# Altium schematic sheet Main sheet.SchDoc: BBB, Status LEDs and I/O pins
size A; DrawnBy: Mr.Farhad Jafari; Engineer: Mr.Farhad Jafari; Address1: www.BasetP.com; Address2: www.BasetP.com; Address3: www.BasetP.com; Address4: www.BasetP.com; Revision: V1.1; SheetNumber: 1; SheetTotal: 5; ProjectName: Humanoid robot
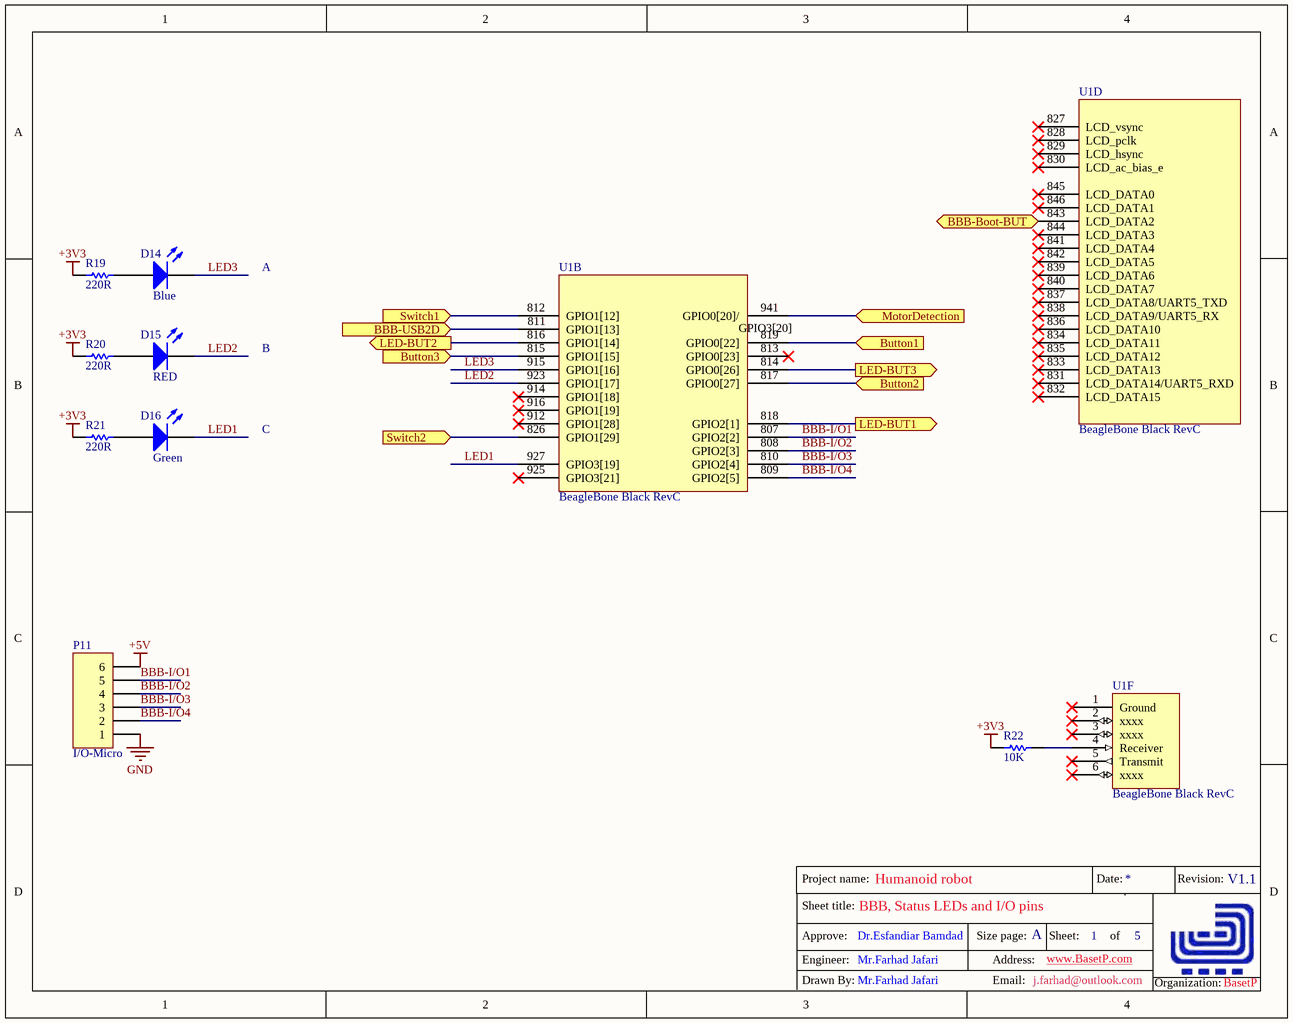
[diagram p0: Main sheet.SchDoc]

## Parts
D14  Blue  [led Blue-0805]
D15  RED  [LED Red-0805]
D16  Green  [LED Green-0805]
P11  I/O-Micro  [HDR1X6]
R19  220R  [6-0805]
R20  220R  [6-0805]
R21  220R  [6-0805]
R22  10K  [6-0805]
U1  BeagleBone Black RevC  [BBB-C]  (parts B,D,F of 6)

## Ports
BBB-Boot-BUT (in), BBB-USB2D (in), Button1 (in), Button2 (in), Button3 (in), LED-BUT1 (out), LED-BUT2 (out), LED-BUT3 (out), MotorDetection (in), Switch1 (in), Switch2 (in)

## Nets
+3V3: R19.1 R20.1 R21.1 R22.1
+5V: P11.6
GND: P11.1
BBB-Boot-BUT: U1.843(LCD_DATA2) ; port BBB-Boot-BUT
BBB-I/O1: P11.5 U1.807(GPIO2[2])
BBB-I/O2: P11.4 U1.808(GPIO2[3])
BBB-I/O3: P11.3 U1.810(GPIO2[4])
BBB-I/O4: P11.2 U1.809(GPIO2[5])
BBB-USB2D: U1.811(GPIO1[13]) ; port BBB-USB2D
Button1: U1.819(GPIO0[22]) ; port Button1
Button2: U1.817(GPIO0[27]) ; port Button2
Button3: U1.815(GPIO1[15]) ; port Button3
LED1: D16.2(K) U1.927(GPIO3[19])
LED2: D15.2(K) U1.923(GPIO1[17])
LED3: D14.2(K) U1.915(GPIO1[16])
LED-BUT1: U1.818(GPIO2[1]) ; port LED-BUT1
LED-BUT2: U1.816(GPIO1[14]) ; port LED-BUT2
LED-BUT3: U1.814(GPIO0[26]) ; port LED-BUT3
MotorDetection: U1.941(GPIO0[20]/) ; port MotorDetection
Switch1: U1.812(GPIO1[12]) ; port Switch1
Switch2: U1.826(GPIO1[29]) ; port Switch2
NetD14_1: D14.1(A) R19.2
NetD15_1: D15.1(A) R20.2
NetD16_1: D16.1(A) R21.2
NetR22_2: R22.2 U1.4(Receiver)

Not connected (* = marked no-connect by the designer): U1 1(Ground)* 2(xxxx)* 3(xxxx)* 5(Transmit)* 6(xxxx)* 813(GPIO0[23])* 827(LCD_vsync)* 828(LCD_pclk)* 829(LCD_hsync)* 830(LCD_ac_bias_e)* 831(LCD_DATA14/UART5_RXD)* 832(LCD_DATA15)* 833(LCD_DATA13)* 834(LCD_DATA11)* 835(LCD_DATA12)* 836(LCD_DATA10)* 837(LCD_DATA8/UART5_TXD)* 838(LCD_DATA9/UART5_RX)* 839(LCD_DATA6)* 840(LCD_DATA7)* 841(LCD_DATA4)* 842(LCD_DATA5)* 844(LCD_DATA3)* 845(LCD_DATA0)* 846(LCD_DATA1)* 912(GPIO1[28])* 914(GPIO1[18])* 916(GPIO1[19])* 925(GPIO3[21])*

## Notes on the sheet
- A
- B
- C
- Sheet title:
- Project name:
- Date:
- Revision:
- Engineer:
- Approve:
- Dr.Esfandiar Bamdad
- Size page:
- Address:
- www.BasetP.com
- Sheet:
- of
- Drawn By:
- Mr.Farhad Jafari
- Email:
- j.farhad@outlook.com
- Organization:
- BasetP
- (in symbol BeagleBoneBlackRevC, part B) GPIO3[20]

## Library data of the parts
D14 = LED-BLUE: High Performance Chip LED, Amber; LuminousIntensity: 25mcd (Minimum).; PCB_Layout: Complies with manufacturer's recommendation.; Published: 11-Dec-2002; DatasheetDocument: 11-Mar-2002; PackageDocument: 29-Oct-2001; PackageReference: 2.0X1.25X0.8; Publisher: Altium Limited; LED_Colour: Amber; ComponentLink1Description: Manufacturer Link; ComponentLink1URL: http://www.agilent.com/; ComponentLink2Description: Datasheet; ComponentLink2URL: http://cp.literature.agilent.com/litweb/pdf/5988-5891EN.pdf
D15 = LED-RED: High Performance Chip LED, Amber; LuminousIntensity: 25mcd (Minimum).; PCB_Layout: Complies with manufacturer's recommendation.; Published: 11-Dec-2002; DatasheetDocument: 11-Mar-2002; PackageDocument: 29-Oct-2001; PackageReference: 2.0X1.25X0.8; Publisher: Altium Limited; LED_Colour: Amber; ComponentLink1Description: Manufacturer Link; ComponentLink1URL: http://www.agilent.com/; ComponentLink2Description: Datasheet; ComponentLink2URL: http://cp.literature.agilent.com/litweb/pdf/5988-5891EN.pdf
D16 = LED-GREEN: High Performance Chip LED, Amber; LuminousIntensity: 25mcd (Minimum).; PCB_Layout: Complies with manufacturer's recommendation.; Published: 11-Dec-2002; DatasheetDocument: 11-Mar-2002; PackageDocument: 29-Oct-2001; PackageReference: 2.0X1.25X0.8; Publisher: Altium Limited; LED_Colour: Amber; ComponentLink1Description: Manufacturer Link; ComponentLink1URL: http://www.agilent.com/; ComponentLink2Description: Datasheet; ComponentLink2URL: http://cp.literature.agilent.com/litweb/pdf/5988-5891EN.pdf
P11 = Header 6: Header, 6-Pin; LatestRevisionDate: 17-Jul-2002; LatestRevisionNote: Re-released for DXP Platform.; Publisher: Altium Limited
R19-R22 = ERJ6RS: Low Ohmic Value Thick Film Chip Resistor, 0.1 Ohm to 0.2 Ohm Range, 1%, 2% and 5% Tolerance, 0805 Size, 0.125 W; Published: 17-Dec-2003; LatestRevisionDate: 19-Mar-2004; LatestRevisionNote: Silkscreen size reduced.; PackageDocument: Mar-2003; PackageReference: 6-0805; Publisher: Altium Limited; Code_IPC: 2012 [0805]; ComponentLink1Description: Manufacturer Link; ComponentLink1URL: http://www.panasonic.com/industrial/components/resistive_products.htm; ComponentLink2Description: Datasheet; ComponentLink2URL: http://www.panasonic.com/industrial/components/pdf/AOA0000CE3.pdf
U1 = BeagleBoneBlackRevC